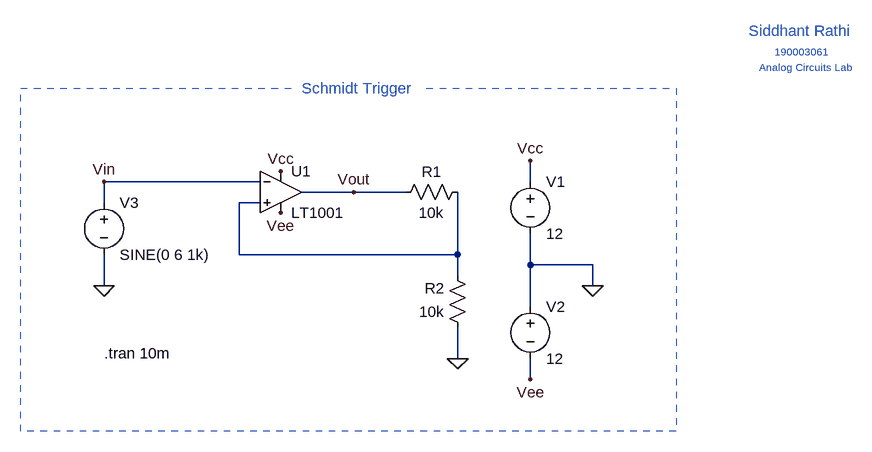
[diagram p0: schematic SchmiddtTrigger.asc]
SchmiddtTrigger.asc, the LTspice schematic file:
Version 4
SHEET 1 1780 680
WIRE 144 176 -96 176
WIRE 560 176 560 144
WIRE 288 192 208 192
WIRE 368 192 288 192
WIRE -96 208 -96 176
WIRE 144 208 112 208
WIRE 112 288 112 208
WIRE 448 288 448 192
WIRE 448 288 112 288
WIRE 560 304 560 256
WIRE 656 304 560 304
WIRE 448 320 448 288
WIRE -96 336 -96 288
WIRE 656 336 656 304
WIRE 560 368 560 304
WIRE 448 448 448 400
WIRE 560 480 560 448
FLAG -96 336 0
FLAG 448 448 0
FLAG 656 336 0
FLAG 560 144 Vcc
FLAG 176 160 Vcc
FLAG 560 480 Vee
FLAG 176 224 Vee
FLAG -96 176 Vin
FLAG 288 192 Vout
SYMBOL OpAmps\\LT1001 176 128 R0
SYMATTR InstName U1
SYMBOL voltage 560 160 R0
WINDOW 123 0 0 Left 0
WINDOW 39 0 0 Left 0
SYMATTR InstName V1
SYMATTR Value 12
SYMBOL voltage 560 352 R0
WINDOW 123 0 0 Left 0
WINDOW 39 0 0 Left 0
SYMATTR InstName V2
SYMATTR Value 12
SYMBOL voltage -96 192 R0
WINDOW 123 0 0 Left 0
WINDOW 39 0 0 Left 0
SYMATTR InstName V3
SYMATTR Value SINE(0 6 1k)
SYMBOL res 464 176 R90
WINDOW 0 0 56 VBottom 2
WINDOW 3 32 56 VTop 2
SYMATTR InstName R1
SYMATTR Value 10k
SYMBOL res 464 416 R180
WINDOW 0 36 76 Left 2
WINDOW 3 36 40 Left 2
SYMATTR InstName R2
SYMATTR Value 10k
TEXT -96 440 Left 2 !.tran 10m
TEXT 208 32 Left 2 ;Schmidt Trigger
TEXT 896 -56 Left 2 ;Siddhant Rathi
TEXT 936 -24 Left 1 ;190003061
TEXT 912 0 Left 1 ;Analog Circuits Lab
LINE Normal -224 32 192 32 2
LINE Normal -224 560 -224 32 2
LINE Normal 784 560 -224 560 2
LINE Normal 784 32 784 560 2
LINE Normal 400 32 784 32 2

The netlist it stands for:
* SchmiddtTrigger.asc
XU1 N001 Vin Vcc Vee Vout LT1001  ; pins In+ In- V+ V- OUT
V1 Vcc 0 12
V2 0 Vee 12
V3 Vin 0 SINE(0 6 1k)
R1 N001 Vout 10k
R2 0 N001 10k
.tran 10m
* Schmidt Trigger
* Siddhant Rathi
* 190003061
* Analog Circuits Lab
.lib LTC.lib
.backanno
.end